# Altium schematic sheet ADCIN_ACcoupled_WBC1-1.SchDoc
size A3
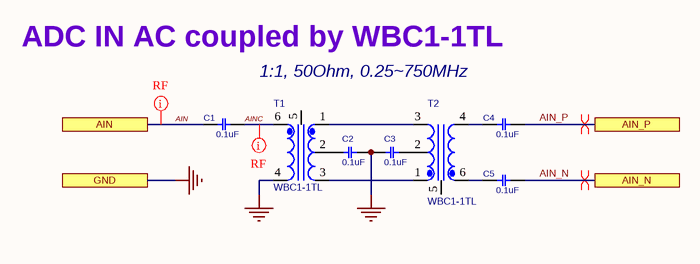
[diagram p0: ADCIN_ACcoupled_WBC1-1.SchDoc]

## Parts
C1  0.1uF  [C0402]
C2  0.1uF  [C0402]
C3  0.1uF  [C0402]
C4  0.1uF  [C0402]
C5  0.1uF  [C0402]
T1  WBC1-1TL  [TRNS150_6_450X420]
T2  WBC1-1TL  [TRNS150_6_450X420]

## Ports
AIN, AIN_N, AIN_P, GND

## Nets
GND: C2.2 C3.1 T1.4(SEC) ; port GND
AIN: C1.1 ; port AIN
AIN_N: C5.2 ; port AIN_N
AIN_P: C4.2 ; port AIN_P
AINC: C1.2 T1.6(SECDOT)
NetC2_1: C2.1 T1.2(PRICT)
NetC3_2: C3.2 T2.2(PRICT)
NetC4_1: C4.1 T2.4(SEC)
NetC5_1: C5.1 T2.6(SECDOT)
NetT1_1: T1.1(PRIDOT) T2.3(PRI)
NetT1_3: T1.3(PRI) T2.1(PRIDOT)

Not connected (* = marked no-connect by the designer): T1 5(NC); T2 5(NC)

## Layout directives
net class RF: AIN, AINC
differential pair: AIN_N, AIN_P

## Notes on the sheet
- ADC IN AC coupled by WBC1-1TL
- 1:1, 50Ohm, 0.25~750MHz
- Title
- Size:
- Date:
- A3
- Number:
- Time:
- Revision:
- Sheet
- of
- File:

## Library data of the parts
C1-C5 = CAP_SMD_MLCC_100n50T: CAP, MLCC; PARAM: X5R, 10%; MANF_P#: GRM155R61E104; MANF: Murata; PARAM2: 25v; ASSEMBLY: ASSEMBLY; PRICE: 10,000:$0.006; VALUE: 0.1uF
T1 T2 = WBC1-1TL: RF Transformer, 1:1, 50Ohm, 0.25~750MHz; MANF: Coilcraft; PARAM2: 36mA; MANF_P#: WBC1-1TL; PARAM: 1:1, 50Ohm, 0.25~750MHz; PRICE: 5$; VALUE: WBC1-1TL